# Altium schematic sheet Flash_Memmory.SchDoc
size A4; SheetNumber: 12; SheetTotal: 12
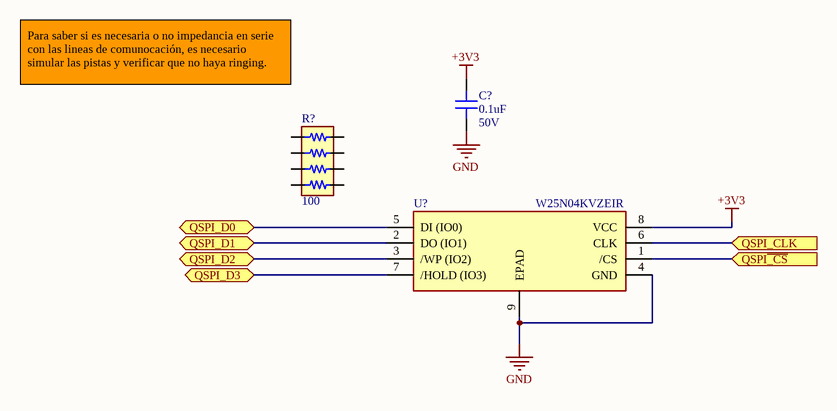
[diagram p0: Flash_Memmory.SchDoc]

## Parts
C?  0.1uF  Voltage: 50V  [CAP0603]
R?  100  [ArrayResistor-1206]
U?  W25N04KVZEIR  [WSON-8]

## Ports
QSPI_CLK (in), QSPI_D0 (bidir), QSPI_D1 (bidir), QSPI_D2 (bidir), QSPI_D3 (bidir), QSPI~{_CS} (in)

## Nets
+3V3: C?.2 U?.8(VCC)
GND: C?.1 U?.4(GND) U?.9(EPAD)
QSPI~{_CS}: U?.1(/CS) ; port QSPI~{_CS}
QSPI_CLK: U?.6(CLK) ; port QSPI_CLK
QSPI_D0: U?.5(DI_(IO0)) ; port QSPI_D0
QSPI_D1: U?.2(DO_(IO1)) ; port QSPI_D1
QSPI_D2: U?.3(/WP_(IO2)) ; port QSPI_D2
QSPI_D3: U?.7(/HOLD_(IO3)) ; port QSPI_D3

Not connected (* = marked no-connect by the designer): R? 1 2 3 4 5 6 7 8

## Notes on the sheet
- Para saber si es necesaria o no impedancia en serie con las lineas de comunocación, es necesario simular las pistas y verificar que no haya ringing.

## Library data of the parts
C? = C0603C104K4RAC7867: CAP CER 0.1UF 16V X7R 0603; ComponentLink1Description: DataSheet; ComponentLink1URL: https://content.kemet.com/datasheets/KEM_C1002_X7R_SMD.pdf; Size: 0603; ComponentLink2Description: DigiKey; ComponentLink2URL: https://www.digikey.com/en/products/detail/kemet/C0603C104K4RAC7867/411095
R? = EXB-38V101JV: RES ARRAY 4 RES 100 OHM 1206; Elements: 4; Value: 100 Ohms; ComponentLink1Description: DigiKey; ComponentLink1URL: https://www.digikey.com/en/products/detail/panasonic-electronic-components/EXB-38V101JV/256519?s=N4IgTCBcDaIKIA0BCBaAzADgGoEYAMOAUliALoC%2BQA; ComponentLink2Description: DataSheet; ComponentLink2URL: https://industrial.panasonic.com/cdbs/www-data/pdf/AOC0000/AOC0000C14.pdf; Size: 1206
U? = W25N04KVZEIR: QSPINAND 4G-BIT FLASH MEMORY WITH DUAL/QUAD SPI BUFFER READ & SEQUENTIAL READ; ComponentLink1Description: Product Brief; ComponentLink1URL: https://www.winbond.com/hq/product/code-storage-flash-memory/qspinand-flash/?__locale=en&partNo=W25N04KV